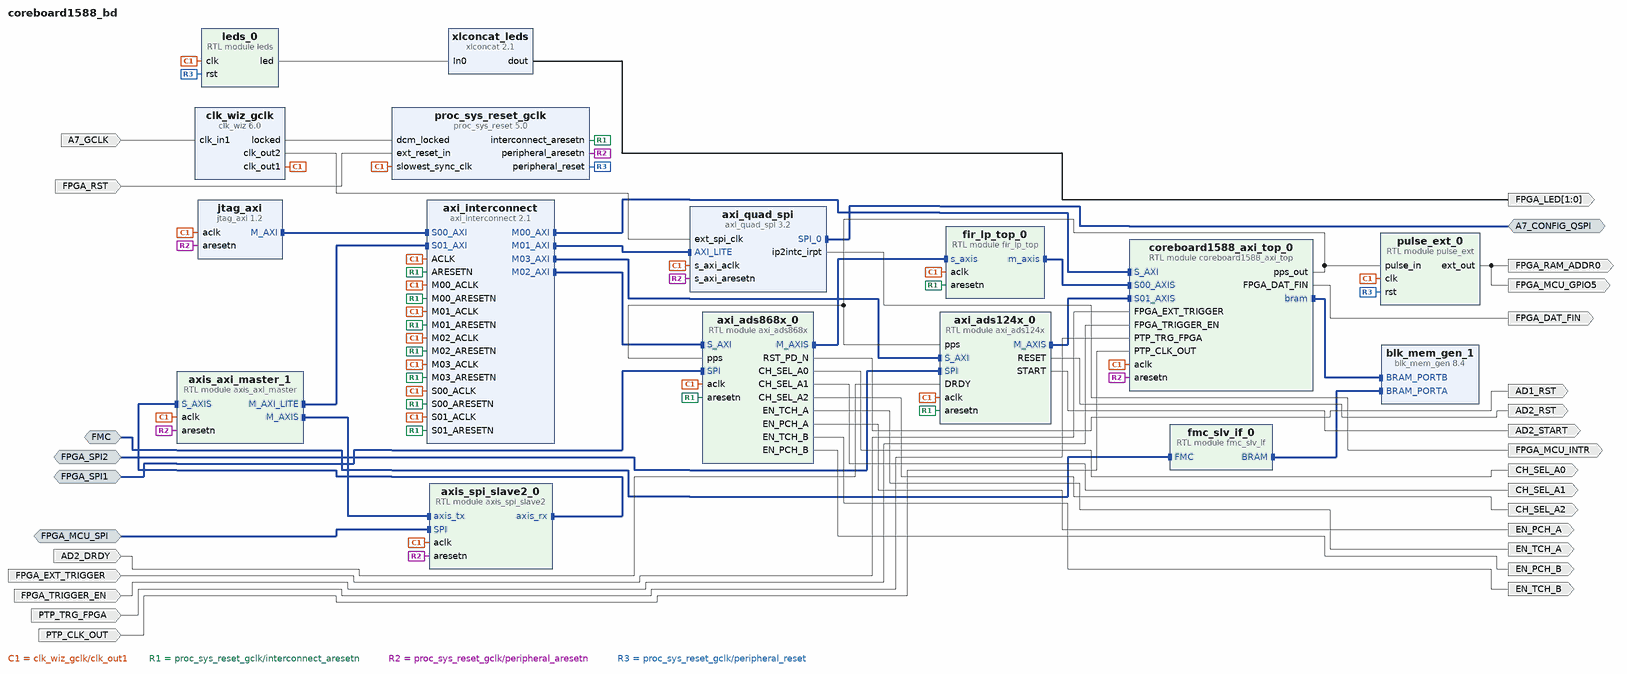
[diagram p0: block diagram of the top level]
# Vivado block design coreboard1588_bd, xc7a100tcsg324-2L, Vivado 2019.2
create_bd_design coreboard1588_bd

create_bd_intf_port -mode Master -vlnv xilinx.com:interface:spi_rtl:1.0 A7_CONFIG_QSPI
create_bd_intf_port -mode Slave -vlnv xilinx.com:interface:spi_rtl:1.0 FPGA_MCU_SPI
create_bd_intf_port -mode Slave -vlnv xilinx.com:interface:emc_rtl:1.0 FMC
create_bd_intf_port -mode Slave -vlnv xilinx.com:interface:spi_rtl:1.0 FPGA_SPI1
create_bd_intf_port -mode Slave -vlnv xilinx.com:interface:spi_rtl:1.0 FPGA_SPI2
create_bd_port -dir I -type rst FPGA_RST
set_property -dict {CONFIG.POLARITY ACTIVE_LOW} [get_bd_ports FPGA_RST]
create_bd_port -dir I -type clk A7_GCLK
set_property -dict {CONFIG.CLK_DOMAIN a7_clk_in CONFIG.FREQ_HZ 25000000} [get_bd_ports A7_GCLK]
create_bd_port -dir O -from 1 -to 0 -type data FPGA_LED
create_bd_port -dir I PTP_TRG_FPGA
create_bd_port -dir O AD1_RST
create_bd_port -dir O CH_SEL_A0
create_bd_port -dir O CH_SEL_A1
create_bd_port -dir O CH_SEL_A2
create_bd_port -dir O EN_TCH_A
create_bd_port -dir O EN_PCH_A
create_bd_port -dir O EN_TCH_B
create_bd_port -dir O EN_PCH_B
create_bd_port -dir O -type intr FPGA_DAT_FIN
create_bd_port -dir I AD2_DRDY
create_bd_port -dir O AD2_START
create_bd_port -dir O -type rst AD2_RST
create_bd_port -dir O -type intr FPGA_MCU_INTR
create_bd_port -dir I FPGA_EXT_TRIGGER
create_bd_port -dir I FPGA_TRIGGER_EN
create_bd_port -dir I PTP_CLK_OUT
create_bd_port -dir O -type intr FPGA_MCU_GPIO5
create_bd_port -dir O -type intr FPGA_RAM_ADDR0

create_bd_cell -type ip -vlnv xilinx.com:ip:axi_interconnect:2.1 axi_interconnect
set_property -dict {CONFIG.NUM_MI 4 CONFIG.NUM_SI 2} [get_bd_cells axi_interconnect]
create_bd_cell -type ip -vlnv xilinx.com:ip:clk_wiz:6.0 clk_wiz_gclk
set_property -dict [list \
  CONFIG.CLKIN1_JITTER_PS 400.0 \
  CONFIG.CLKOUT1_DRIVES BUFG \
  CONFIG.CLKOUT1_JITTER 220.126 \
  CONFIG.CLKOUT1_PHASE_ERROR 237.727 \
  CONFIG.CLKOUT1_REQUESTED_OUT_FREQ 125.000 \
  CONFIG.CLKOUT2_DRIVES BUFG \
  CONFIG.CLKOUT2_JITTER 356.129 \
  CONFIG.CLKOUT2_PHASE_ERROR 237.727 \
  CONFIG.CLKOUT2_REQUESTED_OUT_FREQ 25 \
  CONFIG.CLKOUT2_USED true \
  CONFIG.CLKOUT3_DRIVES BUFG \
  CONFIG.CLKOUT4_DRIVES BUFG \
  CONFIG.CLKOUT5_DRIVES BUFG \
  CONFIG.CLKOUT6_DRIVES BUFG \
  CONFIG.CLKOUT7_DRIVES BUFG \
  CONFIG.MMCM_CLKFBOUT_MULT_F 40.000 \
  CONFIG.MMCM_CLKIN1_PERIOD 40.000 \
  CONFIG.MMCM_CLKIN2_PERIOD 10.0 \
  CONFIG.MMCM_CLKOUT0_DIVIDE_F 8.000 \
  CONFIG.MMCM_CLKOUT1_DIVIDE 40 \
  CONFIG.NUM_OUT_CLKS 2 \
  CONFIG.PRIM_IN_FREQ 25 \
  CONFIG.RESET_PORT reset \
  CONFIG.RESET_TYPE ACTIVE_HIGH \
  CONFIG.SECONDARY_SOURCE Single_ended_clock_capable_pin \
  CONFIG.USE_PHASE_ALIGNMENT false \
  CONFIG.USE_RESET false \
] [get_bd_cells clk_wiz_gclk]
create_bd_cell -type ip -vlnv xilinx.com:ip:jtag_axi:1.2 jtag_axi
set_property -dict {CONFIG.PROTOCOL 2} [get_bd_cells jtag_axi]
create_bd_cell -type ip -vlnv xilinx.com:ip:proc_sys_reset:5.0 proc_sys_reset_gclk
set_property -dict {CONFIG.C_NUM_PERP_ARESETN 1 CONFIG.C_NUM_PERP_RST 1} [get_bd_cells proc_sys_reset_gclk]
create_bd_cell -type ip -vlnv xilinx.com:ip:xlconcat:2.1 xlconcat_leds
create_bd_cell -type ip -vlnv xilinx.com:ip:blk_mem_gen:8.4 blk_mem_gen_1
set_property -dict [list \
  CONFIG.Byte_Size 8 \
  CONFIG.Enable_32bit_Address false \
  CONFIG.Enable_B Use_ENB_Pin \
  CONFIG.Memory_Type True_Dual_Port_RAM \
  CONFIG.Operating_Mode_A WRITE_FIRST \
  CONFIG.Port_B_Clock 100 \
  CONFIG.Port_B_Enable_Rate 100 \
  CONFIG.Port_B_Write_Rate 50 \
  CONFIG.Read_Width_A 16 \
  CONFIG.Read_Width_B 16 \
  CONFIG.Register_PortA_Output_of_Memory_Core true \
  CONFIG.Register_PortA_Output_of_Memory_Primitives true \
  CONFIG.Register_PortB_Output_of_Memory_Primitives true \
  CONFIG.Use_Byte_Write_Enable true \
  CONFIG.Use_RSTA_Pin false \
  CONFIG.Write_Depth_A 4096 \
  CONFIG.Write_Width_A 16 \
  CONFIG.Write_Width_B 16 \
  CONFIG.use_bram_block Stand_Alone \
] [get_bd_cells blk_mem_gen_1]
create_bd_cell -type module -reference fmc_slv_if fmc_slv_if_0
create_bd_cell -type ip -vlnv xilinx.com:ip:axi_quad_spi:3.2 axi_quad_spi
set_property -dict [list \
  CONFIG.Async_Clk 0 \
  CONFIG.C_SPI_MEMORY 2 \
  CONFIG.C_SPI_MODE 2 \
  CONFIG.C_S_AXI4_ID_WIDTH 0 \
] [get_bd_cells axi_quad_spi]
create_bd_cell -type module -reference axis_spi_slave2 axis_spi_slave2_0
create_bd_cell -type module -reference axis_axi_master axis_axi_master_1
create_bd_cell -type module -reference axi_ads868x axi_ads868x_0
create_bd_cell -type module -reference fir_lp_top fir_lp_top_0
create_bd_cell -type module -reference pulse_ext pulse_ext_0
create_bd_cell -type module -reference leds leds_0
set_property -dict {CONFIG.C_CLK_FREQ 125000000} [get_bd_cells leds_0]
create_bd_cell -type module -reference axi_ads124x axi_ads124x_0
create_bd_cell -type module -reference coreboard1588_axi_top coreboard1588_axi_top_0

# ---- connections ----

connect_bd_intf_net [get_bd_intf_pins fir_lp_top_0/m_axis] [get_bd_intf_pins coreboard1588_axi_top_0/S00_AXIS]
connect_bd_intf_net [get_bd_intf_pins fmc_slv_if_0/BRAM] [get_bd_intf_pins blk_mem_gen_1/BRAM_PORTA]
connect_bd_intf_net [get_bd_intf_pins axis_axi_master_1/M_AXI_LITE] [get_bd_intf_pins axi_interconnect/S01_AXI]
connect_bd_intf_net [get_bd_intf_pins coreboard1588_axi_top_0/bram] [get_bd_intf_pins blk_mem_gen_1/BRAM_PORTB]
connect_bd_intf_net [get_bd_intf_ports FMC] [get_bd_intf_pins fmc_slv_if_0/FMC]
connect_bd_intf_net -intf_net SPI_0_3 [get_bd_intf_ports FPGA_SPI2] [get_bd_intf_pins axi_ads124x_0/SPI]
connect_bd_intf_net [get_bd_intf_pins axi_ads124x_0/S_AXI] [get_bd_intf_pins axi_interconnect/M03_AXI]
connect_bd_intf_net [get_bd_intf_pins axi_interconnect/M02_AXI] [get_bd_intf_pins axi_ads868x_0/S_AXI]
connect_bd_intf_net [get_bd_intf_pins coreboard1588_axi_top_0/S_AXI] [get_bd_intf_pins axi_interconnect/M00_AXI]
connect_bd_intf_net [get_bd_intf_pins axi_ads868x_0/M_AXIS] [get_bd_intf_pins fir_lp_top_0/s_axis]
connect_bd_intf_net [get_bd_intf_ports FPGA_MCU_SPI] [get_bd_intf_pins axis_spi_slave2_0/SPI]
connect_bd_intf_net -intf_net axi_quad_spi_0_SPI_0 [get_bd_intf_ports A7_CONFIG_QSPI] [get_bd_intf_pins axi_quad_spi/SPI_0]
connect_bd_intf_net [get_bd_intf_pins axi_quad_spi/AXI_LITE] [get_bd_intf_pins axi_interconnect/M01_AXI]
connect_bd_intf_net [get_bd_intf_pins jtag_axi/M_AXI] [get_bd_intf_pins axi_interconnect/S00_AXI]
connect_bd_intf_net [get_bd_intf_pins axis_axi_master_1/M_AXIS] [get_bd_intf_pins axis_spi_slave2_0/axis_tx]
connect_bd_intf_net [get_bd_intf_pins axis_axi_master_1/S_AXIS] [get_bd_intf_pins axis_spi_slave2_0/axis_rx]
connect_bd_intf_net -intf_net SPI_0_2 [get_bd_intf_ports FPGA_SPI1] [get_bd_intf_pins axi_ads868x_0/SPI]
connect_bd_intf_net [get_bd_intf_pins axi_ads124x_0/M_AXIS] [get_bd_intf_pins coreboard1588_axi_top_0/S01_AXIS]
connect_bd_net -net gclk_100m [get_bd_pins clk_wiz_gclk/clk_out1] \
  [get_bd_pins axi_interconnect/ACLK] [get_bd_pins axi_interconnect/S00_ACLK] [get_bd_pins axi_interconnect/M00_ACLK] \
  [get_bd_pins axi_interconnect/M01_ACLK] [get_bd_pins axi_interconnect/M02_ACLK] [get_bd_pins axi_interconnect/S01_ACLK] \
  [get_bd_pins jtag_axi/aclk] [get_bd_pins proc_sys_reset_gclk/slowest_sync_clk] [get_bd_pins axi_quad_spi/s_axi_aclk] \
  [get_bd_pins axi_interconnect/M03_ACLK] [get_bd_pins axis_spi_slave2_0/aclk] [get_bd_pins axis_axi_master_1/aclk] \
  [get_bd_pins axi_ads868x_0/aclk] [get_bd_pins fir_lp_top_0/aclk] [get_bd_pins pulse_ext_0/clk] [get_bd_pins leds_0/clk] \
  [get_bd_pins axi_ads124x_0/aclk] [get_bd_pins coreboard1588_axi_top_0/aclk]
connect_bd_net -net clk_wiz_locked [get_bd_pins clk_wiz_gclk/locked] [get_bd_pins proc_sys_reset_gclk/dcm_locked]
connect_bd_net -net ARESETN_1 [get_bd_pins proc_sys_reset_gclk/interconnect_aresetn] \
  [get_bd_pins axi_interconnect/ARESETN] [get_bd_pins axi_interconnect/S00_ARESETN] \
  [get_bd_pins axi_interconnect/M00_ARESETN] [get_bd_pins axi_interconnect/M01_ARESETN] \
  [get_bd_pins axi_interconnect/M02_ARESETN] [get_bd_pins axi_interconnect/S01_ARESETN] \
  [get_bd_pins axi_interconnect/M03_ARESETN] [get_bd_pins axi_ads868x_0/aresetn] [get_bd_pins fir_lp_top_0/aresetn] \
  [get_bd_pins axi_ads124x_0/aresetn]
connect_bd_net -net fpga_rst_s [get_bd_ports FPGA_RST] [get_bd_pins proc_sys_reset_gclk/ext_reset_in]
connect_bd_net -net a7_gclk_s [get_bd_ports A7_GCLK] [get_bd_pins clk_wiz_gclk/clk_in1]
connect_bd_net -net gclk_20m [get_bd_pins clk_wiz_gclk/clk_out2] [get_bd_pins axi_quad_spi/ext_spi_clk]
connect_bd_net -net pro_rst_50_peripheral_aresetn [get_bd_pins proc_sys_reset_gclk/peripheral_aresetn] \
  [get_bd_pins jtag_axi/aresetn] [get_bd_pins axi_quad_spi/s_axi_aresetn] [get_bd_pins axis_spi_slave2_0/aresetn] \
  [get_bd_pins axis_axi_master_1/aresetn] [get_bd_pins coreboard1588_axi_top_0/aresetn]
connect_bd_net -net fpga_led_s [get_bd_pins xlconcat_leds/dout] [get_bd_ports FPGA_LED]
connect_bd_net -net pps_receiver_0_pps_out [get_bd_pins coreboard1588_axi_top_0/pps_out] \
  [get_bd_pins axi_ads868x_0/pps] [get_bd_pins pulse_ext_0/pulse_in] [get_bd_pins axi_ads124x_0/pps]
connect_bd_net [get_bd_pins proc_sys_reset_gclk/peripheral_reset] [get_bd_pins pulse_ext_0/rst] [get_bd_pins leds_0/rst]
connect_bd_net [get_bd_pins leds_0/led] [get_bd_pins xlconcat_leds/In0]
connect_bd_net [get_bd_pins axi_ads868x_0/RST_PD_N] [get_bd_ports AD1_RST]
connect_bd_net [get_bd_pins axi_ads868x_0/CH_SEL_A0] [get_bd_ports CH_SEL_A0]
connect_bd_net [get_bd_pins axi_ads868x_0/CH_SEL_A1] [get_bd_ports CH_SEL_A1]
connect_bd_net [get_bd_pins axi_ads868x_0/CH_SEL_A2] [get_bd_ports CH_SEL_A2]
connect_bd_net [get_bd_pins axi_ads868x_0/EN_TCH_A] [get_bd_ports EN_TCH_A]
connect_bd_net [get_bd_pins axi_ads868x_0/EN_PCH_A] [get_bd_ports EN_PCH_A]
connect_bd_net [get_bd_pins axi_ads868x_0/EN_TCH_B] [get_bd_ports EN_TCH_B]
connect_bd_net [get_bd_pins axi_ads868x_0/EN_PCH_B] [get_bd_ports EN_PCH_B]
connect_bd_net -net DRDY_0_1 [get_bd_ports AD2_DRDY] [get_bd_pins axi_ads124x_0/DRDY]
connect_bd_net [get_bd_pins axi_ads124x_0/START] [get_bd_ports AD2_START]
connect_bd_net [get_bd_pins axi_ads124x_0/RESET] [get_bd_ports AD2_RST]
connect_bd_net [get_bd_pins axi_quad_spi/ip2intc_irpt] [get_bd_ports FPGA_MCU_INTR]
connect_bd_net -net FPGA_EXT_TRIGGER_0_1 [get_bd_ports FPGA_EXT_TRIGGER] [get_bd_pins coreboard1588_axi_top_0/FPGA_EXT_TRIGGER]
connect_bd_net -net FPGA_TRIGGER_EN_0_1 [get_bd_ports FPGA_TRIGGER_EN] [get_bd_pins coreboard1588_axi_top_0/FPGA_TRIGGER_EN]
connect_bd_net [get_bd_ports PTP_TRG_FPGA] [get_bd_pins coreboard1588_axi_top_0/PTP_TRG_FPGA]
connect_bd_net -net coreboard1588_axi_top_0_ts_irq [get_bd_pins coreboard1588_axi_top_0/FPGA_DAT_FIN] [get_bd_ports FPGA_DAT_FIN]
connect_bd_net -net PTP_CLK_OUT_0_1 [get_bd_ports PTP_CLK_OUT] [get_bd_pins coreboard1588_axi_top_0/PTP_CLK_OUT]
connect_bd_net [get_bd_pins pulse_ext_0/ext_out] [get_bd_ports FPGA_MCU_GPIO5] [get_bd_ports FPGA_RAM_ADDR0]

# ---- address map ----
assign_bd_address -offset 0x00000000 -range 1K -target_address_space [get_bd_addr_spaces axis_axi_master_1/M_AXI_LITE] [get_bd_addr_segs coreboard1588_axi_top_0/S_AXI/reg0]
assign_bd_address -offset 0x00000400 -range 1K -target_address_space [get_bd_addr_spaces axis_axi_master_1/M_AXI_LITE] [get_bd_addr_segs axi_quad_spi/AXI_LITE/Reg]
assign_bd_address -offset 0x00000C00 -range 1K -target_address_space [get_bd_addr_spaces axis_axi_master_1/M_AXI_LITE] [get_bd_addr_segs axi_ads868x_0/S_AXI/reg0]
assign_bd_address -offset 0x00001000 -range 1K -target_address_space [get_bd_addr_spaces axis_axi_master_1/M_AXI_LITE] [get_bd_addr_segs axi_ads124x_0/S_AXI/reg0]
assign_bd_address -offset 0x00000000 -range 1K -target_address_space [get_bd_addr_spaces jtag_axi/Data] [get_bd_addr_segs coreboard1588_axi_top_0/S_AXI/reg0]
assign_bd_address -offset 0x00000400 -range 1K -target_address_space [get_bd_addr_spaces jtag_axi/Data] [get_bd_addr_segs axi_quad_spi/AXI_LITE/Reg]
assign_bd_address -offset 0x00000C00 -range 1K -target_address_space [get_bd_addr_spaces jtag_axi/Data] [get_bd_addr_segs axi_ads868x_0/S_AXI/reg0]
assign_bd_address -offset 0x00001000 -range 1K -target_address_space [get_bd_addr_spaces jtag_axi/Data] [get_bd_addr_segs axi_ads124x_0/S_AXI/reg0]

validate_bd_design
save_bd_design
